# Altium schematic sheet LevelBridge.SchDoc
size A4
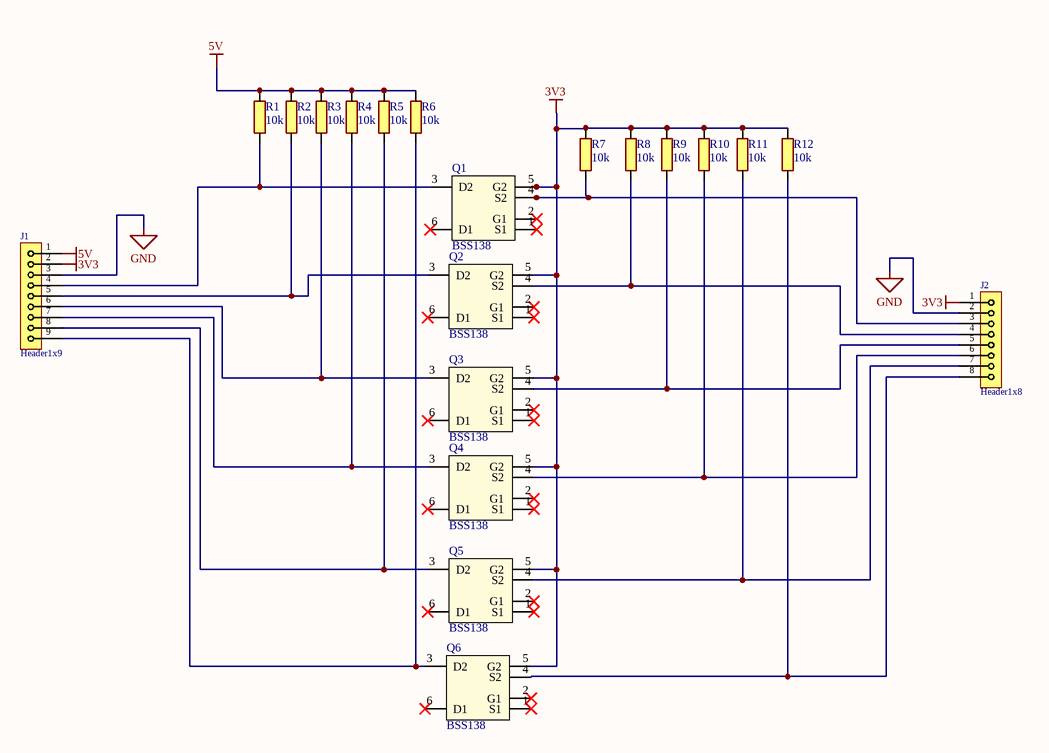
[diagram p0: LevelBridge.SchDoc]

## Parts
J1  Header1x9  [HDRV9W64P254_1X9_2286X254X900B]
J2  Header1x8  [HDRV8W64P254_1X8_2032X254X900B]
Q1  BSS138  [PCBComponent_1]
Q2  BSS138  [PCBComponent_1]
Q3  BSS138  [PCBComponent_1]
Q4  BSS138  [PCBComponent_1]
Q5  BSS138  [PCBComponent_1]
Q6  BSS138  [PCBComponent_1]
R1  10k  [RESC0603(1608)_N]
R2  10k  [RESC0603(1608)_N]
R3  10k  [RESC0603(1608)_N]
R4  10k  [RESC0603(1608)_N]
R5  10k  [RESC0603(1608)_N]
R6  10k  [RESC0603(1608)_N]
R7  10k  [RESC0603(1608)_N]
R8  10k  [RESC0603(1608)_N]
R9  10k  [RESC0603(1608)_N]
R10  10k  [RESC0603(1608)_N]
R11  10k  [RESC0603(1608)_N]
R12  10k  [RESC0603(1608)_N]

## Nets
3V3: J1.2 J2.1 Q1.5(G2) Q2.5(G2) Q3.5(G2) Q4.5(G2) Q5.5(G2) Q6.5(G2) R7.2 R8.2 R9.2 R10.2 R11.2 R12.2
5V: J1.1 R1.2 R2.2 R3.2 R4.2 R5.2 R6.2
GND: J1.3 J2.2
NetJ1_4: J1.4 Q1.3(D2) R1.1
NetJ1_5: J1.5 Q2.3(D2) R2.1
NetJ1_6: J1.6 Q3.3(D2) R3.1
NetJ1_7: J1.7 Q4.3(D2) R4.1
NetJ1_8: J1.8 Q5.3(D2) R5.1
NetJ1_9: J1.9 Q6.3(D2) R6.1
NetJ2_3: J2.3 Q1.4(S2) R7.1
NetJ2_4: J2.4 Q2.4(S2) R8.1
NetJ2_5: J2.5 Q3.4(S2) R9.1
NetJ2_6: J2.6 Q4.4(S2) R10.1
NetJ2_7: J2.7 Q5.4(S2) R11.1
NetJ2_8: J2.8 Q6.4(S2) R12.1

Not connected (* = marked no-connect by the designer): Q1 1(S1)* 2(G1)* 6(D1)*; Q2 1(S1)* 2(G1)* 6(D1)*; Q3 1(S1)* 2(G1)* 6(D1)*; Q4 1(S1)* 2(G1)* 6(D1)*; Q5 1(S1)* 2(G1)* 6(D1)*; Q6 1(S1)* 2(G1)* 6(D1)*

## Library data of the parts
J1 = 2436: id: 2436; pakke_opprettet_av: 815; pakke_opprettet: 13.11.2014 12.32.21; symbol_opprettet: 13.11.2014 11.00.52; beskrivelse: 2,54mm pitch; pris: 5; pakketype: TH; symbol_opprettet_av: 815; navn: Header 1x9
J2 = 2435: id: 2435; pakke_opprettet_av: 815; pakke_opprettet: 13.11.2014 12.32.07; symbol_opprettet: 13.11.2014 11.00.45; beskrivelse: 2,54mm pitch; pris: 4; pakketype: TH; symbol_opprettet_av: 815; navn: Header 1x8
Q1-Q6 = BSS138: FET SM NCH 50V 220mA SOT23-3L
R1-R12 = 2444: 0.1W 1% Thick film resistor; id: 2444; rad: -1; rom: OV; lager_type: Fremlager; dybde: 72; hylle: 6; antall: 100; kolonne: 0; pakke_opprettet_av: 815; pakke_opprettet: 08.07.2014 21.15.30; symbol_opprettet: 08.07.2014 21.16.33; leverandor_varenr: 2447230; nokkelord: Resistor Motstand; produsent: Multikomp; leverandor: Farnell; pakketype: 0603; symbol_opprettet_av: 815; navn: 10k; pris: 0